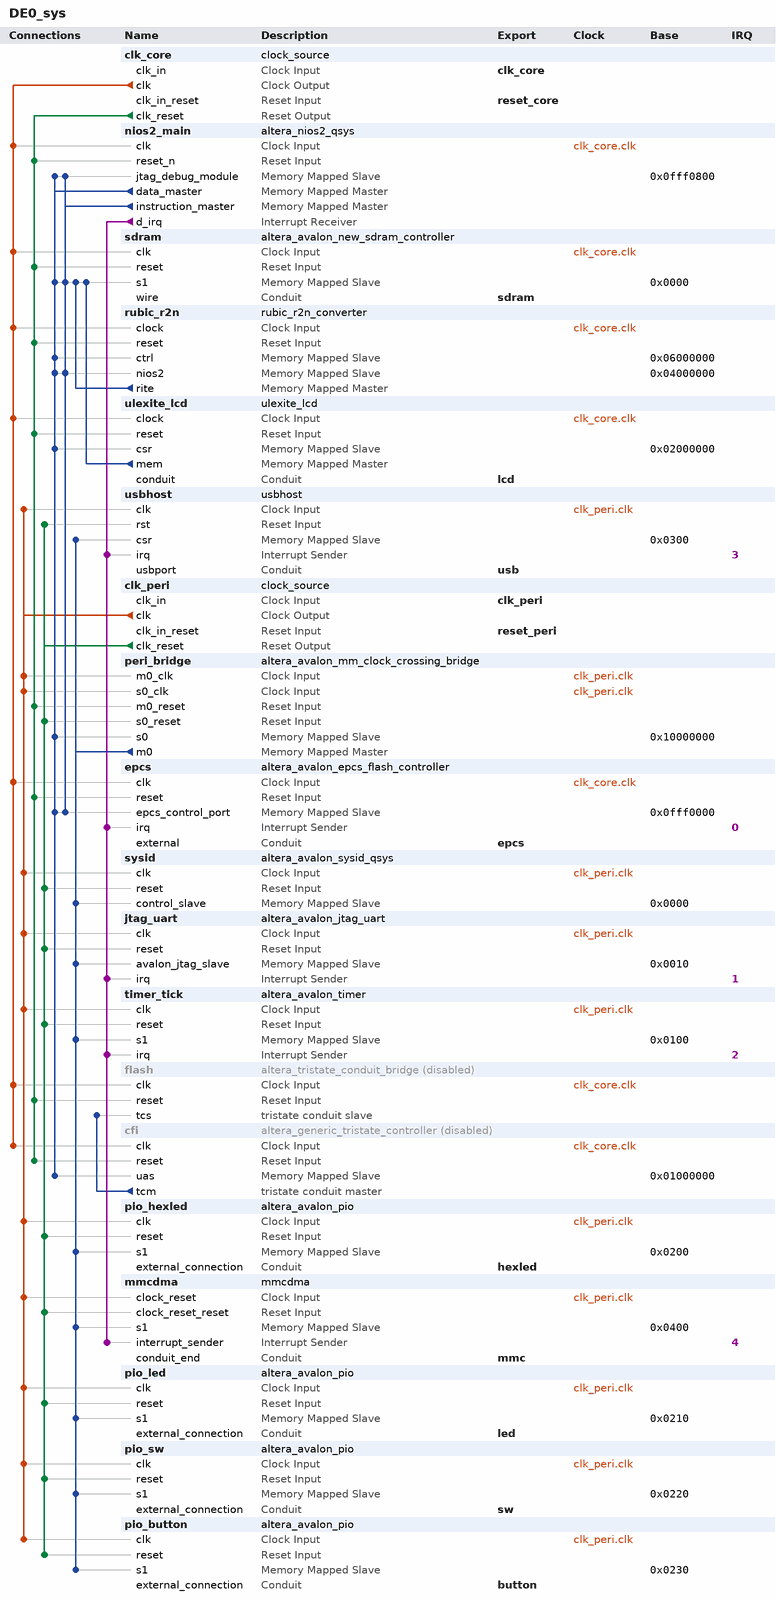
[diagram p0: system contents]
# Platform Designer (Qsys) system DE0_sys, Cyclone III EP3C16F484C6
# Parameters at their usual value, and those the tool derives, are not listed.
package require -exact qsys 13.1
create_system DE0_sys
set_project_property DEVICE_FAMILY {Cyclone III}
set_project_property DEVICE EP3C16F484C6

add_instance clk_core clock_source 13.1
set_instance_parameter_value clk_core clockFrequency 100000000

add_instance nios2_main altera_nios2_qsys 13.1
set_instance_parameter_value nios2_main resetSlave epcs.epcs_control_port
set_instance_parameter_value nios2_main mmu_TLBMissExcSlave None
set_instance_parameter_value nios2_main exceptionSlave sdram.s1
set_instance_parameter_value nios2_main breakSlave nios2_main.jtag_debug_module
set_instance_parameter_value nios2_main impl Small
set_instance_parameter_value nios2_main icache_size 4096

add_instance sdram altera_avalon_new_sdram_controller 13.1
set_instance_parameter_value sdram TAC 5.5
set_instance_parameter_value sdram TRCD 18.0
set_instance_parameter_value sdram TRFC 60.0
set_instance_parameter_value sdram TRP 18.0
set_instance_parameter_value sdram casLatency 3
set_instance_parameter_value sdram columnWidth 8
set_instance_parameter_value sdram dataWidth 16
set_instance_parameter_value sdram generateSimulationModel false
set_instance_parameter_value sdram initRefreshCommands 8
set_instance_parameter_value sdram model single_Micron_MT48LC4M32B2_7_chip
set_instance_parameter_value sdram numberOfBanks 4
set_instance_parameter_value sdram numberOfChipSelects 1
set_instance_parameter_value sdram powerUpDelay 200.0
set_instance_parameter_value sdram refreshPeriod 15.625
set_instance_parameter_value sdram rowWidth 12

add_instance rubic_r2n rubic_r2n_converter 1.1
set_instance_parameter_value rubic_r2n RITE_MEM_WIDTH 23

add_instance ulexite_lcd ulexite_lcd 1.0
set_instance_parameter_value ulexite_lcd H_PERIOD 525
set_instance_parameter_value ulexite_lcd H_SYNC 45
set_instance_parameter_value ulexite_lcd H_ACTIVE 480
set_instance_parameter_value ulexite_lcd V_PERIOD 288
set_instance_parameter_value ulexite_lcd V_SYNC 16
set_instance_parameter_value ulexite_lcd V_ACTIVE 272
set_instance_parameter_value ulexite_lcd MEM_BASE 8126464

add_instance usbhost usbhost 2.0
set_instance_parameter_value usbhost HOST_FIFO_DEPTH 64
set_instance_parameter_value usbhost HOST_FIFO_ADDR_WIDTH 6

add_instance clk_peri clock_source 13.1
set_instance_parameter_value clk_peri clockFrequency 50000000

add_instance peri_bridge altera_avalon_mm_clock_crossing_bridge 13.1
set_instance_parameter_value peri_bridge DATA_WIDTH 32
set_instance_parameter_value peri_bridge ADDRESS_WIDTH 12
set_instance_parameter_value peri_bridge MAX_BURST_SIZE 1
set_instance_parameter_value peri_bridge COMMAND_FIFO_DEPTH 4
set_instance_parameter_value peri_bridge RESPONSE_FIFO_DEPTH 4
set_instance_parameter_value peri_bridge MASTER_SYNC_DEPTH 2
set_instance_parameter_value peri_bridge SLAVE_SYNC_DEPTH 2

add_instance epcs altera_avalon_epcs_flash_controller 13.1

add_instance sysid altera_avalon_sysid_qsys 13.1
set_instance_parameter_value sysid id 0

add_instance jtag_uart altera_avalon_jtag_uart 13.1
set_instance_parameter_value jtag_uart simInteractiveOptions NO_INTERACTIVE_WINDOWS

add_instance timer_tick altera_avalon_timer 13.1
set_instance_parameter_value timer_tick alwaysRun true
set_instance_parameter_value timer_tick fixedPeriod true
set_instance_parameter_value timer_tick period 1
set_instance_parameter_value timer_tick periodUnits MSEC
set_instance_parameter_value timer_tick snapshot false

add_instance flash altera_tristate_conduit_bridge 13.1
set_instance_property flash ENABLED false

add_instance cfi altera_generic_tristate_controller 13.1
set_instance_property cfi ENABLED false
set_instance_parameter_value cfi TCM_ADDRESS_W 22
set_instance_parameter_value cfi TCM_DATA_W 16
set_instance_parameter_value cfi TCM_BYTEENABLE_W 2
set_instance_parameter_value cfi TCM_READ_WAIT 30
set_instance_parameter_value cfi TCM_WRITE_WAIT 30
set_instance_parameter_value cfi TCM_SETUP_WAIT 40
set_instance_parameter_value cfi TCM_DATA_HOLD 0
set_instance_parameter_value cfi TCM_MAX_PENDING_READ_TRANSACTIONS 3
set_instance_parameter_value cfi TCM_TURNAROUND_TIME 2
set_instance_parameter_value cfi TCM_TIMING_UNITS 0
set_instance_parameter_value cfi TCM_READLATENCY 2
set_instance_parameter_value cfi TCM_SYMBOLS_PER_WORD 1
set_instance_parameter_value cfi USE_READ 1
set_instance_parameter_value cfi USE_BEGINTRANSFER 0
set_instance_parameter_value cfi USE_BYTEENABLE 0
set_instance_parameter_value cfi USE_WAITREQUEST 1
set_instance_parameter_value cfi USE_OUTPUTENABLE 0
set_instance_parameter_value cfi USE_RESET_OUTPUT 1
set_instance_parameter_value cfi ACTIVE_LOW_READ 1
set_instance_parameter_value cfi ACTIVE_LOW_BYTEENABLE 0
set_instance_parameter_value cfi ACTIVE_LOW_OUTPUTENABLE 0
set_instance_parameter_value cfi ACTIVE_LOW_WAITREQUEST 1
set_instance_parameter_value cfi ACTIVE_LOW_BEGINTRANSFER 0
set_instance_parameter_value cfi ACTIVE_LOW_RESET_OUTPUT 1
set_instance_parameter_value cfi CHIPSELECT_THROUGH_READLATENCY 0
set_instance_parameter_value cfi MODULE_ASSIGNMENT_KEYS embeddedsw.configuration.hwClassnameDriverSupportList,embeddedsw.configuration.hwClassnameDriverSupportDefault,embeddedsw.CMacro.SETUP_VALUE,embeddedsw.CMacro.WAIT_VALUE,embeddedsw.CMacro.HOLD_VALUE,embeddedsw.CMacro.TIMING_UNITS,embeddedsw.CMacro.SIZE,embeddedsw.memoryInfo.MEM_INIT_DATA_WIDTH,embeddedsw.memoryInfo.HAS_BYTE_LANE,embeddedsw.memoryInfo.IS_FLASH,embeddedsw.memoryInfo.GENERATE_DAT_SYM,embeddedsw.memoryInfo.GENERATE_FLASH,embeddedsw.memoryInfo.DAT_SYM_INSTALL_DIR,embeddedsw.memoryInfo.FLASH_INSTALL_DIR
set_instance_parameter_value cfi MODULE_ASSIGNMENT_VALUES altera_avalon_cfi_flash,altera_avalon_cfi_flash,40,30,0,ns,4194304u,16,0,1,1,1,SIM_DIR,APP_DIR
set_instance_parameter_value cfi INTERFACE_ASSIGNMENT_KEYS embeddedsw.configuration.isFlash,embeddedsw.configuration.isMemoryDevice,embeddedsw.configuration.isNonVolatileStorage
set_instance_parameter_value cfi INTERFACE_ASSIGNMENT_VALUES 1,1,1

add_instance pio_hexled altera_avalon_pio 13.1
set_instance_parameter_value pio_hexled direction Output
set_instance_parameter_value pio_hexled resetValue 4294967295
set_instance_parameter_value pio_hexled width 32

add_instance mmcdma mmcdma 1.0

add_instance pio_led altera_avalon_pio 13.1
set_instance_parameter_value pio_led direction Output
set_instance_parameter_value pio_led width 10

add_instance pio_sw altera_avalon_pio 13.1
set_instance_parameter_value pio_sw direction Input
set_instance_parameter_value pio_sw width 10

add_instance pio_button altera_avalon_pio 13.1
set_instance_parameter_value pio_button direction Input
set_instance_parameter_value pio_button width 2

# connections
add_connection clk_core.clk cfi.clk clock
add_connection clk_core.clk epcs.clk clock
add_connection clk_core.clk flash.clk clock
add_connection clk_core.clk nios2_main.clk clock
add_connection clk_core.clk rubic_r2n.clock clock
add_connection clk_core.clk sdram.clk clock
add_connection clk_core.clk ulexite_lcd.clock clock
add_connection clk_peri.clk jtag_uart.clk clock
add_connection clk_peri.clk mmcdma.clock_reset clock
add_connection clk_peri.clk peri_bridge.m0_clk clock
add_connection clk_peri.clk peri_bridge.s0_clk clock
add_connection clk_peri.clk pio_button.clk clock
add_connection clk_peri.clk pio_hexled.clk clock
add_connection clk_peri.clk pio_led.clk clock
add_connection clk_peri.clk pio_sw.clk clock
add_connection clk_peri.clk sysid.clk clock
add_connection clk_peri.clk timer_tick.clk clock
add_connection clk_peri.clk usbhost.clk clock
add_connection clk_core.clk_reset cfi.reset reset
add_connection clk_core.clk_reset epcs.reset reset
add_connection clk_core.clk_reset flash.reset reset
add_connection clk_core.clk_reset nios2_main.reset_n reset
add_connection clk_core.clk_reset peri_bridge.m0_reset reset
add_connection clk_core.clk_reset rubic_r2n.reset reset
add_connection clk_core.clk_reset sdram.reset reset
add_connection clk_core.clk_reset ulexite_lcd.reset reset
add_connection clk_peri.clk_reset jtag_uart.reset reset
add_connection clk_peri.clk_reset mmcdma.clock_reset_reset reset
add_connection clk_peri.clk_reset peri_bridge.s0_reset reset
add_connection clk_peri.clk_reset pio_button.reset reset
add_connection clk_peri.clk_reset pio_hexled.reset reset
add_connection clk_peri.clk_reset pio_led.reset reset
add_connection clk_peri.clk_reset pio_sw.reset reset
add_connection clk_peri.clk_reset sysid.reset reset
add_connection clk_peri.clk_reset timer_tick.reset reset
add_connection clk_peri.clk_reset usbhost.rst reset
add_connection nios2_main.data_master cfi.uas avalon
set_connection_parameter_value nios2_main.data_master/cfi.uas baseAddress 0x01000000
add_connection nios2_main.data_master epcs.epcs_control_port avalon
set_connection_parameter_value nios2_main.data_master/epcs.epcs_control_port baseAddress 0x0fff0000
add_connection nios2_main.data_master nios2_main.jtag_debug_module avalon
set_connection_parameter_value nios2_main.data_master/nios2_main.jtag_debug_module baseAddress 0x0fff0800
add_connection nios2_main.data_master peri_bridge.s0 avalon
set_connection_parameter_value nios2_main.data_master/peri_bridge.s0 baseAddress 0x10000000
add_connection nios2_main.data_master rubic_r2n.ctrl avalon
set_connection_parameter_value nios2_main.data_master/rubic_r2n.ctrl baseAddress 0x06000000
add_connection nios2_main.data_master rubic_r2n.nios2 avalon
set_connection_parameter_value nios2_main.data_master/rubic_r2n.nios2 baseAddress 0x04000000
add_connection nios2_main.data_master sdram.s1 avalon
set_connection_parameter_value nios2_main.data_master/sdram.s1 baseAddress 0x0000
add_connection nios2_main.data_master ulexite_lcd.csr avalon
set_connection_parameter_value nios2_main.data_master/ulexite_lcd.csr baseAddress 0x02000000
add_connection nios2_main.instruction_master epcs.epcs_control_port avalon
set_connection_parameter_value nios2_main.instruction_master/epcs.epcs_control_port baseAddress 0x0fff0000
add_connection nios2_main.instruction_master nios2_main.jtag_debug_module avalon
set_connection_parameter_value nios2_main.instruction_master/nios2_main.jtag_debug_module baseAddress 0x0fff0800
add_connection nios2_main.instruction_master rubic_r2n.nios2 avalon
set_connection_parameter_value nios2_main.instruction_master/rubic_r2n.nios2 baseAddress 0x04000000
add_connection nios2_main.instruction_master sdram.s1 avalon
set_connection_parameter_value nios2_main.instruction_master/sdram.s1 baseAddress 0x0000
add_connection peri_bridge.m0 jtag_uart.avalon_jtag_slave avalon
set_connection_parameter_value peri_bridge.m0/jtag_uart.avalon_jtag_slave baseAddress 0x0010
add_connection peri_bridge.m0 mmcdma.s1 avalon
set_connection_parameter_value peri_bridge.m0/mmcdma.s1 baseAddress 0x0400
add_connection peri_bridge.m0 pio_button.s1 avalon
set_connection_parameter_value peri_bridge.m0/pio_button.s1 baseAddress 0x0230
add_connection peri_bridge.m0 pio_hexled.s1 avalon
set_connection_parameter_value peri_bridge.m0/pio_hexled.s1 baseAddress 0x0200
add_connection peri_bridge.m0 pio_led.s1 avalon
set_connection_parameter_value peri_bridge.m0/pio_led.s1 baseAddress 0x0210
add_connection peri_bridge.m0 pio_sw.s1 avalon
set_connection_parameter_value peri_bridge.m0/pio_sw.s1 baseAddress 0x0220
add_connection peri_bridge.m0 sysid.control_slave avalon
set_connection_parameter_value peri_bridge.m0/sysid.control_slave baseAddress 0x0000
add_connection peri_bridge.m0 timer_tick.s1 avalon
set_connection_parameter_value peri_bridge.m0/timer_tick.s1 baseAddress 0x0100
add_connection peri_bridge.m0 usbhost.csr avalon
set_connection_parameter_value peri_bridge.m0/usbhost.csr baseAddress 0x0300
add_connection rubic_r2n.rite sdram.s1 avalon
set_connection_parameter_value rubic_r2n.rite/sdram.s1 baseAddress 0x0000
add_connection ulexite_lcd.mem sdram.s1 avalon
set_connection_parameter_value ulexite_lcd.mem/sdram.s1 arbitrationPriority 2
set_connection_parameter_value ulexite_lcd.mem/sdram.s1 baseAddress 0x0000
add_connection nios2_main.d_irq epcs.irq interrupt
set_connection_parameter_value nios2_main.d_irq/epcs.irq irqNumber 0
add_connection nios2_main.d_irq jtag_uart.irq interrupt
set_connection_parameter_value nios2_main.d_irq/jtag_uart.irq irqNumber 1
add_connection nios2_main.d_irq mmcdma.interrupt_sender interrupt
set_connection_parameter_value nios2_main.d_irq/mmcdma.interrupt_sender irqNumber 4
add_connection nios2_main.d_irq timer_tick.irq interrupt
set_connection_parameter_value nios2_main.d_irq/timer_tick.irq irqNumber 2
add_connection nios2_main.d_irq usbhost.irq interrupt
set_connection_parameter_value nios2_main.d_irq/usbhost.irq irqNumber 3
add_connection cfi.tcm flash.tcs tristate_conduit

# exported interfaces
add_interface sdram conduit end
set_interface_property sdram EXPORT_OF sdram.wire
add_interface clk_core clock sink
set_interface_property clk_core EXPORT_OF clk_core.clk_in
add_interface reset_core reset sink
set_interface_property reset_core EXPORT_OF clk_core.clk_in_reset
add_interface lcd conduit end
set_interface_property lcd EXPORT_OF ulexite_lcd.conduit
add_interface usb conduit end
set_interface_property usb EXPORT_OF usbhost.usbport
add_interface clk_peri clock sink
set_interface_property clk_peri EXPORT_OF clk_peri.clk_in
add_interface reset_peri reset sink
set_interface_property reset_peri EXPORT_OF clk_peri.clk_in_reset
add_interface hexled conduit end
set_interface_property hexled EXPORT_OF pio_hexled.external_connection
add_interface epcs conduit end
set_interface_property epcs EXPORT_OF epcs.external
add_interface mmc conduit end
set_interface_property mmc EXPORT_OF mmcdma.conduit_end
add_interface led conduit end
set_interface_property led EXPORT_OF pio_led.external_connection
add_interface sw conduit end
set_interface_property sw EXPORT_OF pio_sw.external_connection
add_interface button conduit end
set_interface_property button EXPORT_OF pio_button.external_connection

set_interconnect_requirement {$system} qsys_mm.clockCrossingAdapter HANDSHAKE
set_interconnect_requirement {$system} qsys_mm.maxAdditionalLatency 1
set_interconnect_requirement {$system} qsys_mm.insertDefaultSlave false

save_system DE0_sys.qsys
